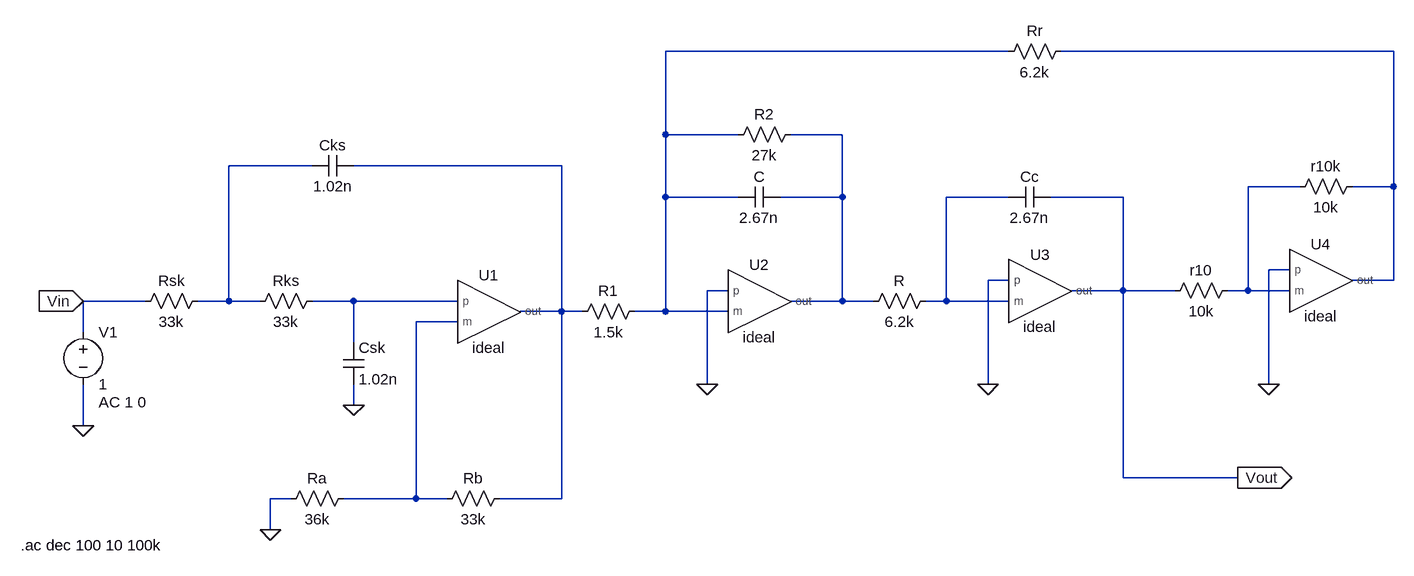
[diagram p0: schematic CommercialRCTTSK.asc]
CommercialRCTTSK.asc, the LTspice schematic file:
Version 4
SHEET 1 2292 680
WIRE 1360 -288 832 -288
WIRE 1952 -288 1440 -288
WIRE 832 -160 832 -288
WIRE 944 -160 832 -160
WIRE 1104 -160 1024 -160
WIRE 288 -112 160 -112
WIRE 672 -112 352 -112
WIRE 1808 -80 1728 -80
WIRE 1952 -80 1952 -288
WIRE 1952 -80 1888 -80
WIRE 832 -64 832 -160
WIRE 944 -64 832 -64
WIRE 1104 -64 1104 -160
WIRE 1104 -64 1008 -64
WIRE 1360 -64 1264 -64
WIRE 1536 -64 1424 -64
WIRE 1792 48 1760 48
WIRE 1360 64 1328 64
WIRE 1952 64 1952 -80
WIRE 1952 64 1888 64
WIRE 928 80 896 80
WIRE 1536 80 1536 -64
WIRE 1536 80 1456 80
WIRE 1616 80 1536 80
WIRE 1728 80 1728 -80
WIRE 1728 80 1696 80
WIRE 1792 80 1728 80
WIRE 32 96 -64 96
WIRE 160 96 160 -112
WIRE 160 96 112 96
WIRE 208 96 160 96
WIRE 352 96 288 96
WIRE 512 96 352 96
WIRE 1104 96 1104 -64
WIRE 1104 96 1024 96
WIRE 1152 96 1104 96
WIRE 1264 96 1264 -64
WIRE 1264 96 1232 96
WIRE 1360 96 1264 96
WIRE 672 112 672 -112
WIRE 672 112 608 112
WIRE 704 112 672 112
WIRE 832 112 832 -64
WIRE 832 112 784 112
WIRE 928 112 832 112
WIRE 512 128 448 128
WIRE -64 144 -64 96
WIRE 352 160 352 96
WIRE 896 224 896 80
WIRE 1328 224 1328 64
WIRE 1760 224 1760 48
WIRE 352 256 352 224
WIRE -64 288 -64 224
WIRE 1536 368 1536 80
WIRE 1712 368 1536 368
WIRE 256 400 224 400
WIRE 448 400 448 128
WIRE 448 400 336 400
WIRE 496 400 448 400
WIRE 672 400 672 112
WIRE 672 400 576 400
WIRE 224 448 224 400
FLAG -64 96 Vin
IOPIN -64 96 In
FLAG -64 288 0
FLAG 352 256 0
FLAG 224 448 0
FLAG 896 224 0
FLAG 1328 224 0
FLAG 1760 224 0
FLAG 1712 368 Vout
IOPIN 1712 368 Out
SYMBOL voltage -64 128 R0
WINDOW 123 24 124 Left 2
WINDOW 39 0 0 Left 0
SYMATTR Value2 AC 1 0
SYMATTR InstName V1
SYMATTR Value 1
SYMBOL res 128 80 R90
WINDOW 0 0 56 VBottom 2
WINDOW 3 32 56 VTop 2
SYMATTR InstName Rsk
SYMATTR Value 33k
SYMBOL res 304 80 R90
WINDOW 0 0 56 VBottom 2
WINDOW 3 32 56 VTop 2
SYMATTR InstName Rks
SYMATTR Value 33k
SYMBOL cap 352 -128 R90
WINDOW 0 0 32 VBottom 2
WINDOW 3 32 32 VTop 2
SYMATTR InstName Cks
SYMATTR Value 1.02n
SYMBOL cap 336 160 R0
SYMATTR InstName Csk
SYMATTR Value 1.02n
SYMBOL res 352 384 R90
WINDOW 0 0 56 VBottom 2
WINDOW 3 32 56 VTop 2
SYMATTR InstName Ra
SYMATTR Value 36k
SYMBOL res 592 384 R90
WINDOW 0 0 56 VBottom 2
WINDOW 3 32 56 VTop 2
SYMATTR InstName Rb
SYMATTR Value 33k
SYMBOL AutoGenerated\\ideal 560 112 R0
WINDOW 39 0 64 Invisible 2
SYMATTR InstName U1
SYMBOL res 688 128 R270
WINDOW 0 32 56 VTop 2
WINDOW 3 0 56 VBottom 2
SYMATTR InstName R1
SYMATTR Value 1.5k
SYMBOL res 1456 -304 R90
WINDOW 0 0 56 VBottom 2
WINDOW 3 32 56 VTop 2
SYMATTR InstName Rr
SYMATTR Value 6.2k
SYMBOL res 1040 -176 R90
WINDOW 0 0 56 VBottom 2
WINDOW 3 32 56 VTop 2
SYMATTR InstName R2
SYMATTR Value 27k
SYMBOL res 1248 80 R90
WINDOW 0 0 56 VBottom 2
WINDOW 3 32 56 VTop 2
SYMATTR InstName R
SYMATTR Value 6.2k
SYMBOL res 1712 64 R90
WINDOW 0 0 56 VBottom 2
WINDOW 3 32 56 VTop 2
SYMATTR InstName r10
SYMATTR Value 10k
SYMBOL res 1904 -96 R90
WINDOW 0 0 56 VBottom 2
WINDOW 3 32 56 VTop 2
SYMATTR InstName r10k
SYMATTR Value 10k
SYMBOL AutoGenerated\\ideal 976 96 R0
WINDOW 39 0 64 Invisible 2
SYMATTR InstName U2
SYMBOL AutoGenerated\\ideal 1408 80 R0
WINDOW 39 0 64 Invisible 2
SYMATTR InstName U3
SYMBOL AutoGenerated\\ideal 1840 64 R0
WINDOW 39 0 64 Invisible 2
SYMATTR InstName U4
SYMBOL cap 1008 -80 R90
WINDOW 0 0 32 VBottom 2
WINDOW 3 32 32 VTop 2
SYMATTR InstName C
SYMATTR Value 2.67n
SYMBOL cap 1424 -80 R90
WINDOW 0 0 32 VBottom 2
WINDOW 3 32 32 VTop 2
SYMATTR InstName Cc
SYMATTR Value 2.67n
TEXT -160 472 Left 2 !.ac dec 100 10 100k

The netlist it stands for:
* CommercialRCTTSK.asc
V1 Vin 0 1 AC 1 0
Rsk N004 Vin 33k
Rks N008 N004 33k
Cks N005 N004 1.02n
Csk N008 0 1.02n
Ra N009 0 36k
Rb N005 N009 33k
XU1 N008 N009 N005 ideal Rin=1e9, Rout=1, A=1e9  ; pins p m out
R1 N005 N001 1.5k
Rr N002 N001 6.2k
R2 N003 N001 27k
R N007 N003 6.2k
r10 N006 Vout 10k
r10k N002 N006 10k
XU2 0 N001 N003 ideal Rin=1e9, Rout=1, A=1e9  ; pins p m out
XU3 0 N007 Vout ideal Rin=1e9, Rout=1, A=1e9  ; pins p m out
XU4 0 N006 N002 ideal Rin=1e9, Rout=1, A=1e9  ; pins p m out
C N003 N001 2.67n
Cc Vout N007 2.67n
.ac dec 100 10 100k
.lib C:\Users\andre\Desktop\Universita\PrimoAnno\SecondoSemestre\ProgettiAnalogici\FilterProject\LTspice\opamp.lib
.backanno
.end